# EAGLE design Logic_Level_Bidirectional (EAGLE 6.4)
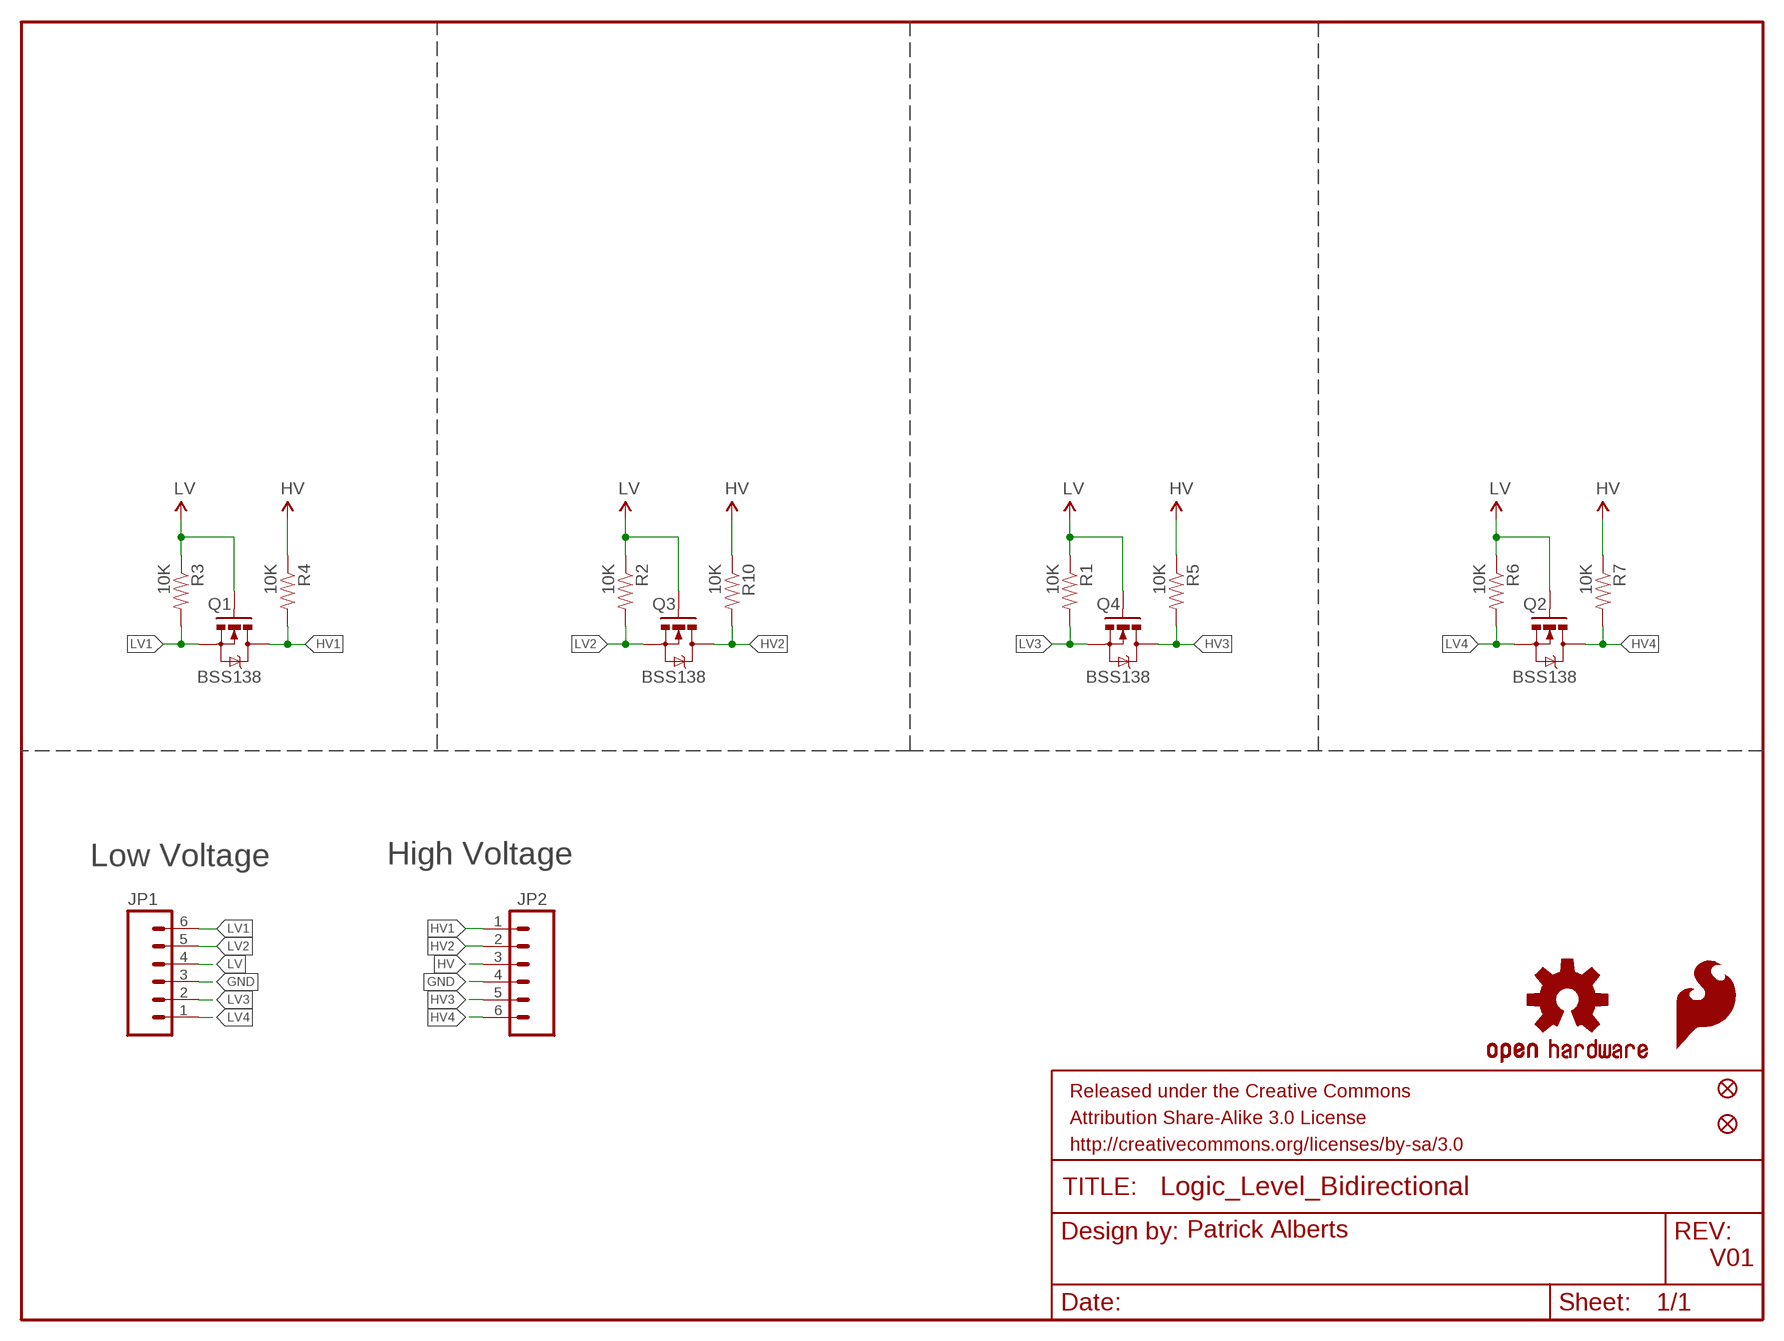
[diagram p0: schematic, sheet 1]

## Parts
JP1  M06SIP  [1X06]
JP2  M06SIP  [1X06]
JP3  FIDUCIALUFIDUCIAL  [MICRO-FIDUCIAL]
JP4  FIDUCIALUFIDUCIAL  [MICRO-FIDUCIAL]
LOGO1  SFE_LOGO_FLAME.1_INCH  [SFE_LOGO_FLAME_.1]
LOGO2  OSHW-LOGOS  [OSHW-LOGO-S]
Q1  BSS138  MOSFET-NCHANNELSMD  [SOT23-3]
Q2  BSS138  MOSFET-NCHANNELSMD  [SOT23-3]
Q3  BSS138  MOSFET-NCHANNELSMD  [SOT23-3]
Q4  BSS138  MOSFET-NCHANNELSMD  [SOT23-3]
R1  10K  RESISTOR0603-RES  [0603-RES]
R2  10K  RESISTOR0603-RES  [0603-RES]
R3  10K  RESISTOR0603-RES  [0603-RES]
R4  10K  RESISTOR0603-RES  [0603-RES]
R5  10K  RESISTOR0603-RES  [0603-RES]
R6  10K  RESISTOR0603-RES  [0603-RES]
R7  10K  RESISTOR0603-RES  [0603-RES]
R10  10K  RESISTOR0603-RES  [0603-RES]

## Nets
GND: JP1.3 JP2.4
HV: JP2.3 R4.1 R5.1 R7.1 R10.1
HV1: JP2.1 Q1.3(D) R4.2
HV2: JP2.2 Q3.3(D) R10.2
HV3: JP2.5 Q4.3(D) R5.2
HV4: JP2.6 Q2.3(D) R7.2
LV: JP1.4 Q1.1(G) Q2.1(G) Q3.1(G) Q4.1(G) R1.1 R2.1 R3.1 R6.1
LV1: JP1.6 Q1.2(S) R3.2
LV2: JP1.5 Q3.2(S) R2.2
LV3: JP1.2 Q4.2(S) R1.2
LV4: JP1.1 Q2.2(S) R6.2

## Notes on the sheet
- Low Voltage | High Voltage
- Patrick Alberts
- V01

## Library data of the parts
JP1 JP2 = SparkFun:M06: Header 6 Standard 6-pin 0.1" header. Use with straight break away headers (SKU : PRT-00116), right angle break away headers (PRT-00553), swiss pins (PRT-00743), machine pins (PRT-00117), and female headers (PRT-00115). Molex polarized connector foot print use with SKU : PRT-08094 with associated crimp pins and housings. NOTES ON THE VARIANTS LOCK and LOCK_LONGPADS... This footprint was designed to help hold the alignment of a through-hole component (i.e. 6-pin header) while soldering it into place. You may notice that each hole has been shifted either up or down by 0.005 of an inch from it's more standard position (which is a perfectly straight line). This slight alteration caused the pins (the squares in the middle) to touch the edges of the holes. Because they are alternating, it causes a "brace" to hold the component in place. 0.005 has proven to be the perfect amount of "off-center" position when using our standard breakaway headers. Although looks a little odd when you look at the bare footprint, once you have a header in there, the alteration is very hard to notice. Also, if you push a header all the way into place, it is covered up entirely on the bottom side. This idea of altering the position of holes to aid alignment will be further integrated into the Sparkfun Library for other footprints. It can help hold any component with 3 or more connection pins.
JP3 JP4 = SparkFun-Aesthetics:FIDUCIAL: Fiducial Alignment Points Various fiducial points for machine vision alignment.
LOGO1 = SparkFun-Aesthetics:SFE_LOGO_FLAME: SFE Logo, flame only This is the SparkFun flame logo. The logo on the schematic will always be the same size; the package variant is the height of the flame. Default layer for the logo on the board is tSilk.
LOGO2 = SparkFun-Aesthetics:OSHW-LOGO: Open Source Hardware Logo This logo indicates the piece of hardware it is found on incorporates a OSHW license and/or adheres to the definition of open source hardware found here: http://freedomdefined.org/OSHW
Q1-Q4 = SparkFun:MOSFET-NCHANNEL
R1-R7 R10 = SparkFun:RESISTOR: Resistor Basic schematic elements and footprints for 0603, 1206, and PTH resistors.

## Board
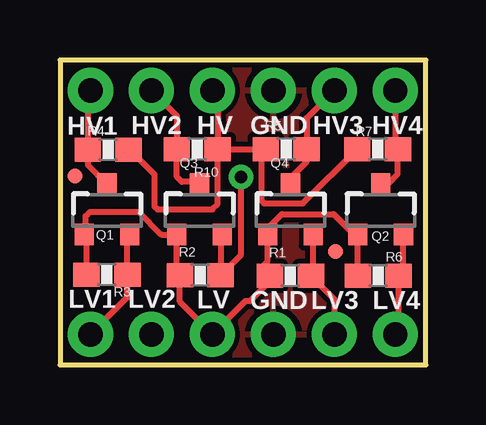
[diagram p1: board, top side]
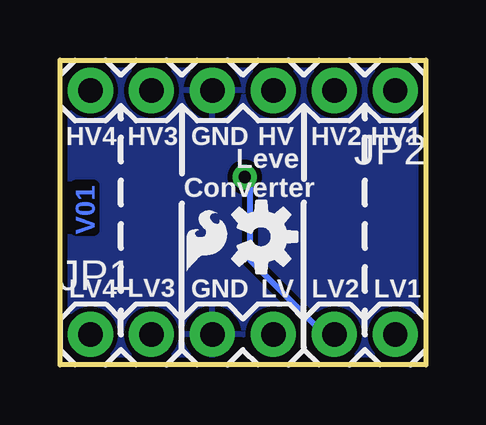
[diagram p2: board, bottom side, seen from below]

Size 15.24 x 12.7 mm. Coordinates in mm from the lower left corner, seen from the top.
Outline: 0,0 15.24,0 15.24,12.7 0,12.7 0,0
Copper layers (1*16): Top 0.035mm / dielectric 1.5mm / Bottom 0.035mm
Design rules "SparkFun *": minimum track width 7mil, minimum drill 15mil, track to track 8mil, track to pad 8mil, pad to pad 8mil, via to via 8mil, smd to smd 8mil, copper to edge 8mil, drill to drill 8mil, minimum pad ring 12mil, minimum via ring 10mil, stop-mask expansion 4mil, vias tented up to drill 20mil, thermal gap 10mil

### Footprints (pad centres in the part's own frame; a part is rotated, then mirrored left to right if it is on the bottom)
1X06 = drill 1.016 pad 1.88: 1 0,0; 2 2.54,0; 3 5.08,0; 4 7.62,0; 5 10.16,0; 6 12.7,0
MICRO-FIDUCIAL = smd 0.635 x 0.635: 1 0,0
SOT23-3 = smd 0.8 x 0.9: 1 -0.95,-1; 2 0.95,-1; 3 0,1.1
0603-RES = smd 1.1 x 1: 1 -0.85,0; 2 0.85,0

### Placement (x,y rotation side)
JP1  13.97,1.27 0 bottom
JP2  1.27,11.43 180 bottom
JP3  0.64,7.87 0 top
JP4  11.48,4.72 0 top
LOGO1  10.29,3.56 0 bottom
LOGO2  6.86,5.33 270 bottom
Q1  1.96,6.43 0 top
Q2  13.36,6.43 0 top
Q3  5.82,6.43 0 top
Q4  9.6,6.43 0 top
R1  9.6,3.71 0 top
R2  5.84,3.73 0 top
R3  1.96,3.76 0 top
R4  2.01,8.97 180 top
R5  9.42,8.99 0 top
R6  13.26,3.71 0 top
R7  13.23,8.99 0 top
R10  5.71,8.99 180 top

### Tracks (layer width: path | path; a pad name or v marks a point on that pad's centre or on a via)
GND
  pour Top: 0,12.7 15.24,12.7 15.24,0 0,0
  pour Bottom: 0,12.7 15.24,12.7 15.24,0 0,0
HV
  Top 0.254: R10.1 R5.1 8.38,8.8 8.38,6.86 8.51,6.73 10.12,6.73 R7.1 | R4.1 2.91,8.97 3.94,7.94 3.94,6.6 4.06,6.48 6.35,6.48 6.57,6.69 R10.1 | JP2.3 6.57,11.21 R10.1
HV1
  Top 0.254: JP2.1 1.16,11.32 R4.2 1.16,8.32 Q1.3
HV2
  Top 0.254: JP2.2 4.87,10.38 R10.2 4.87,7.83 5.08,7.62 5.72,7.62 Q3.3
HV3
  Top 0.254: JP2.5 10.27,10.27 R5.2 10.27,8.45 9.6,7.78 Q4.3
HV4
  Top 0.254: Q2.3 13.65,7.53 14.07,7.95 R7.2 13.97,9.11 JP2.6
LV
  Top 0.254: R3.1 1.11,5.33 1.07,5.37 | 1.07,5.37 Q1.1 | 1.07,5.37 1.07,6.2 1.25,6.38 3.28,6.38 4.23,5.43 Q3.1 4.87,3.86 R2.1 4.99,2.63 JP1.4 7.75,2.67 7.92,2.67 8.75,3.49 R1.1 8.4,4.06 8.65,4.32 Q4.1 8.65,5.68 9.24,6.27 11.4,6.27 12.25,5.43 Q2.1 | 12.18,5.43 Q2.1 | R6.1 12.28,3.83 12.41,3.96 Q2.1
LV1
  Top 0.254: Q1.2 2.81,5.33 R3.2 2.81,2.81 JP1.6
LV2  (via drill 0.51)
  Top 0.254: v7.54,7.82 7.54,4.59 R2.2 6.69,5.35 Q3.2
  Bottom 0.254: JP1.5 4.23,1.27 7.31,4.35 7.31,7.59 v7.54,7.82
LV3
  Top 0.254: JP1.2 11.43,2.73 R1.2 10.3,3.86 10.55,4.12 Q4.2
LV4
  Top 0.254: JP1.1 14.11,1.41 R6.2 14.31,3.91 Q2.2

### Text on the board
Bottom: V01
tPlace: HV1 | HV2 | HV | GND | HV3 | HV4 | LV1 | LV2 | LV | GND | LV3 | LV4
bPlace: HV1 | Level / Converter | HV2 | HV | GND | HV3 | HV4 | LV1 | LV2 | LV | GND | LV3 | LV4
tValues: Nathan Seidle | Rev V13 by Patrick Alberts